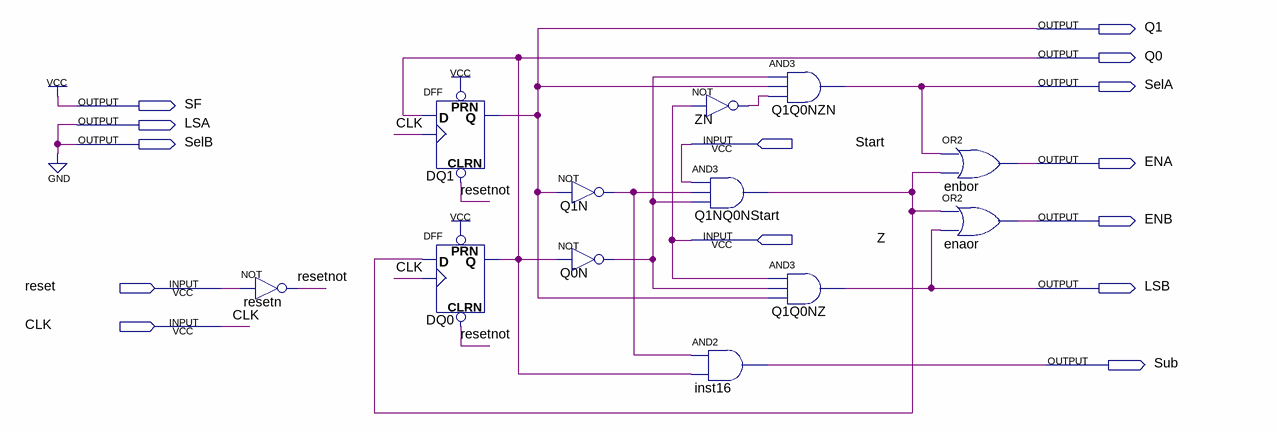
[diagram p0: schematic sheet]
// Quartus schematic ControlUnitBackkup.bdf as structural Verilog: 12 symbols, 14 pins
module ControlUnitBackkup (
  input  Start,
  input  Z,
  input  reset,
  input  CLK,
  output Q1,
  output Q0,
  output SelA,
  output SF,
  output LSA,
  output SelB,
  output ENA,
  output ENB,
  output LSB,
  output Sub
);

  wire Q0N_out, Q1N_out, Q1NQ0NStart_out, resetnot, ZN_out;

  not resetn (resetnot, reset);
  DFF DQ1 (.CLRN(resetnot), .CLK(CLK), .D(Q0), .PRN(1'b1), .Q(Q1));
  DFF DQ0 (.CLRN(resetnot), .CLK(CLK), .D(Q1NQ0NStart_out), .PRN(1'b1), .Q(Q0));
  not Q1N (Q1N_out, Q1);
  not Q0N (Q0N_out, Q0);
  not ZN (ZN_out, Z);
  and Q1NQ0NStart (Q1NQ0NStart_out, Start, Q1N_out, Q0N_out);
  and inst16 (Sub, Q1N_out, Q0);
  and Q1Q0NZN (SelA, Q0N_out, Q1, ZN_out);
  and Q1Q0NZ (LSB, Z, Q0N_out, Q1);
  or enbor (ENA, SelA, Q1NQ0NStart_out);
  or enaor (ENB, Q1NQ0NStart_out, LSB);

  assign LSA = 1'b0;
  assign SelB = 1'b0;
  assign SF = 1'b1;
endmodule
